# EAGLE design filter-test (EAGLE 9.6.2)
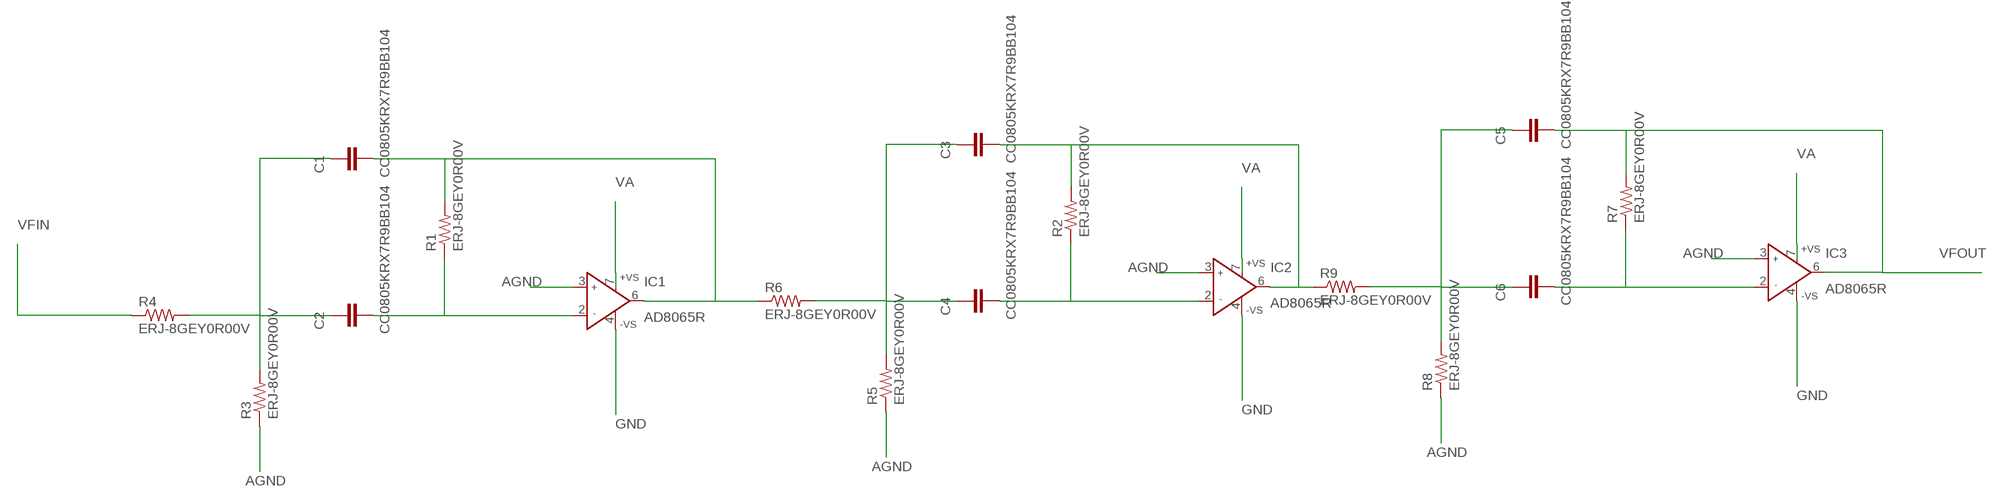
[diagram p0: schematic, sheet 1, part 1 of 2]
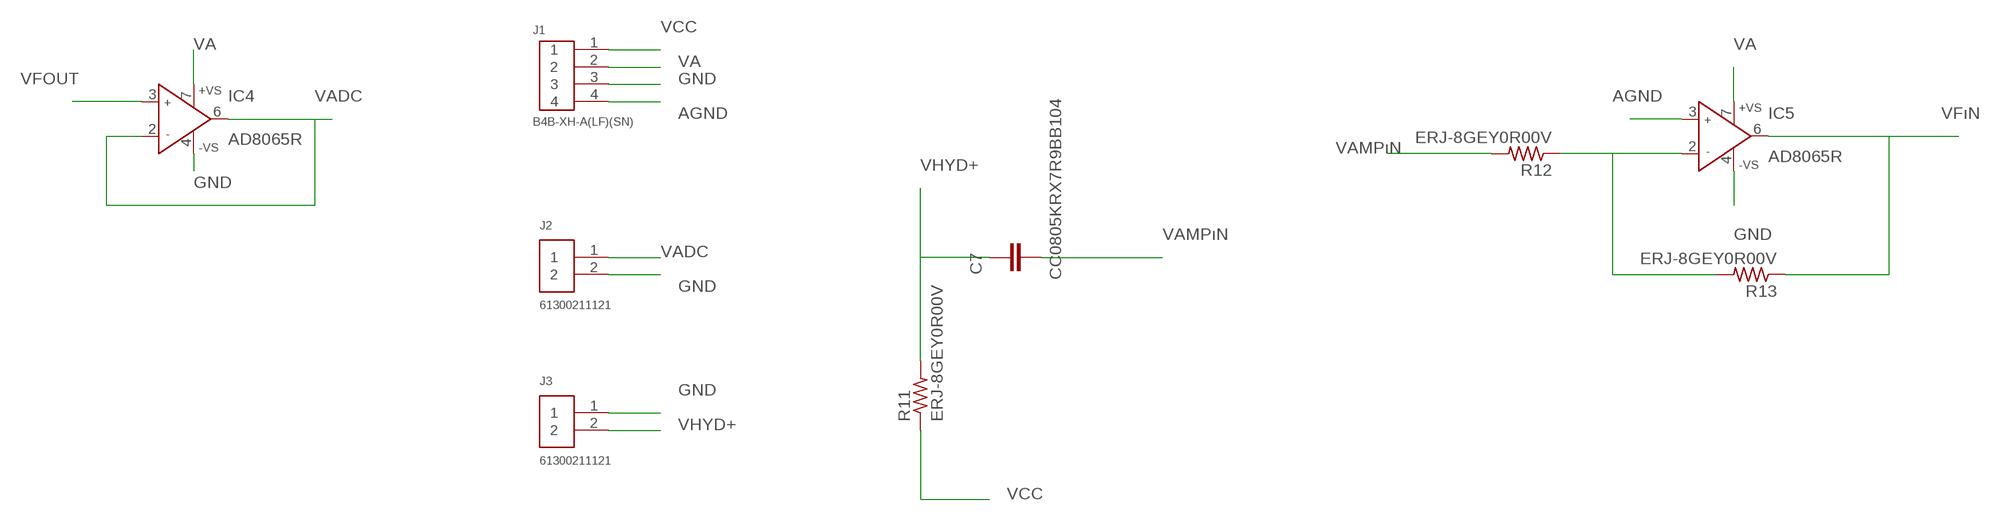
[diagram p1: schematic, sheet 1, part 2 of 2]

## Parts
C1  CC0805KRX7R9BB104  [CAP_0805]
C2  CC0805KRX7R9BB104  [CAP_0805]
C3  CC0805KRX7R9BB104  [CAP_0805]
C4  CC0805KRX7R9BB104  [CAP_0805]
C5  CC0805KRX7R9BB104  [CAP_0805]
C6  CC0805KRX7R9BB104  [CAP_0805]
C7  CC0805KRX7R9BB104  [CAP_0805]
IC1  AD8065R  [SO8]
IC2  AD8065R  [SO8]
IC3  AD8065R  [SO8]
IC4  AD8065R  [SO8]
IC5  AD8065R  [SO8]
J1  B4B-XH-A(LF)(SN)  [B4B-XH-A(LF)(SN)]
J2  61300211121  [61300211121]
J3  61300211121  [61300211121]
R1  ERJ-8GEY0R00V  [RES_1206]
R2  ERJ-8GEY0R00V  [RES_1206]
R3  ERJ-8GEY0R00V  [RES_1206]
R4  ERJ-8GEY0R00V  [RES_1206]
R5  ERJ-8GEY0R00V  [RES_1206]
R6  ERJ-8GEY0R00V  [RES_1206]
R7  ERJ-8GEY0R00V  [RES_1206]
R8  ERJ-8GEY0R00V  [RES_1206]
R9  ERJ-8GEY0R00V  [RES_1206]
R11  ERJ-8GEY0R00V  [RES_1206]
R12  ERJ-8GEY0R00V  [RES_1206]
R13  ERJ-8GEY0R00V  [RES_1206]

## Nets
AGND: IC1.3(IN+) IC2.3(IN+) IC3.3(IN+) IC5.3(IN+) J1.4 R3.1 R5.1 R8.1
GND: IC1.4(-VS) IC2.4(-VS) IC3.4(-VS) IC4.4(-VS) IC5.4(-VS) J1.3 J2.2 J3.1
N$1: C1.1 C2.1 R3.2 R4.2
N$2: C1.2 IC1.6(OUT) R1.2 R6.1
N$3: C2.2 IC1.2(IN-) R1.1
N$4: C3.1 C4.1 R5.2 R6.2
N$5: C3.2 IC2.6(OUT) R2.2 R9.1
N$6: C4.2 IC2.2(IN-) R2.1
N$7: IC5.2(IN-) R12.1 R13.2
N$8: C5.1 C6.1 R8.2 R9.2
N$10: C6.2 IC3.2(IN-) R7.1
VA: IC1.7(+VS) IC2.7(+VS) IC3.7(+VS) IC4.7(+VS) IC5.7(+VS) J1.2
VADC: IC4.2(IN-) IC4.6(OUT) J2.1
VAMPıN: C7.2 R12.2
VCC: J1.1 R11.1
VFIN: R4.1
VFOUT: C5.2 IC3.6(OUT) IC4.3(IN+) R7.2
VFıN: IC5.6(OUT) R13.1
VHYD+: C7.1 J3.2 R11.2

## Library data of the parts
C1-C7 = Resistor_Capacitor:CC0805KRX7R9BB104: CAP CER 0.1UF 50V X7R 0805 Manufacturer's datasheet <http://www.yageo.com/documents/recent/UPY-GPHC_X7R_6.3V-to-50V_18.pdf>; CREATED_BY: PCBLayout.com; DIGIKEY_PART_NUMBER: 311-1140-2-ND; MANUFACTURER: Yageo; MPN: CC0805KRX7R9BB104; PACKAGE: SMD 0805
IC1-IC5 = analog-devices:AD8065: High Performance, 145 MHz FastFET Op Amps Source: http://www.analog.com/static/imported-files/data_sheets/AD8065_8066.pdf; OC_FARNELL: unknown; OC_NEWARK: unknown
J1 = Headers:B4B-XH-A(LF)(SN): CONN HEADER VERT 4POS 2.5MM Manufacturer's datasheet <http://www.jst-mfg.com/product/pdf/eng/eXH.pdf>; CREATED_BY: PCBLayout.com; DIGIKEY_PARTNO: 455-2249-ND; MANUFACTURER: JST Sales America Inc.; MPN: B4B-XH-A(LF)(SN)
J2 J3 = Headers:61300211121: CONN HEADER VERT 2POS 2.54MM Manufacturer's datasheet <https://katalog.we-online.de/em/datasheet/6130xx11121.pdf>; CREATED_BY: PCBLayout.com; DIGI_KEY_PART_NUMBER: 732-5315-ND; MANUFACTURER: Wurth Electronics Inc.; MPN: 61300211121
R1-R9 R11-R13 = Resistor_Capacitor:ERJ-8GEY0R00V: RES SMD 0 OHM JUMPER 1/4W 1206 Manufacturer's datasheet <https://industrial.panasonic.com/ww/products/resistors/chip-resistors/general-purpose-chip-resistors/thick-film-chip-resistors/ERJ8GEY0R00V>; CREATED_BY: PCBLayout.com; DIGIKEY_PART_NUMBER: P0.0ETR-ND; MANUFACTURER: Panasonic Electronic Components; MPN: ERJ-8GEY0R00V; PACKAGE: SMD 1206

## Module AGND
Ports: 

### Library data of the parts

## Module GND
Ports: 

### Library data of the parts

## Board
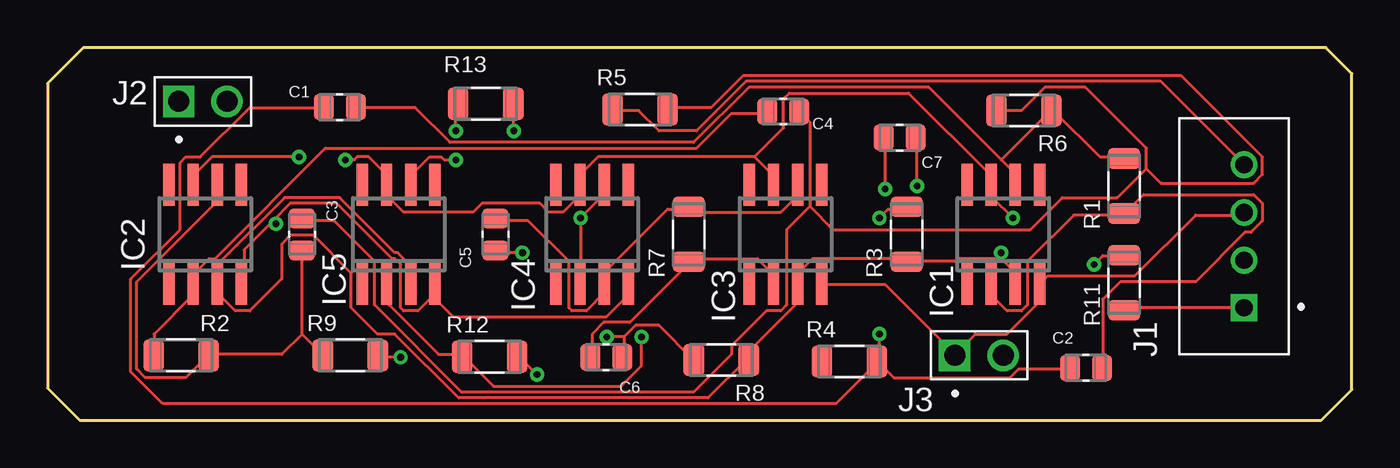
[diagram p2: board, top side]
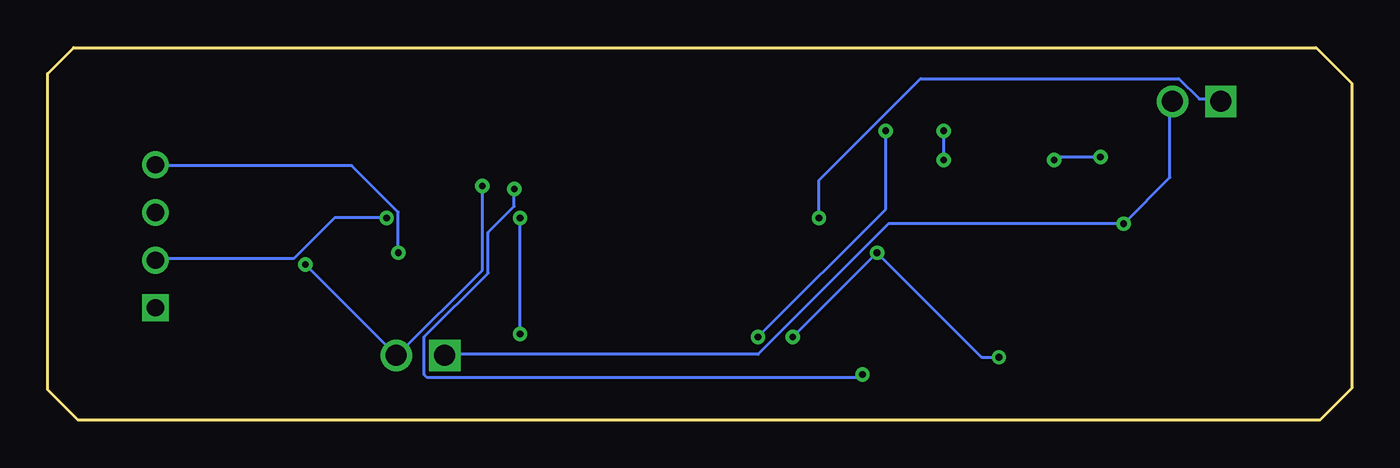
[diagram p3: board, bottom side, seen from below]

Size 68.5 x 19.56 mm. Coordinates in mm from the lower left corner, seen from the top.
Outline: 1.68,0 66.9,0 68.5,1.6 68.5,18.19 67.13,19.56 1.88,19.56 0,17.68 0,1.68 1.68,0
Copper layers (1*16): Top 0.035mm / dielectric 1.5mm / Bottom 0.035mm
Design rules "default": minimum track width 6mil, minimum drill 0.35mm, track to track 6mil, track to pad 6mil, pad to pad 6mil, via to via 6mil, smd to smd 6mil, copper to edge 40mil, drill to drill 6mil, minimum pad ring 10mil, minimum via ring 8mil, stop-mask expansion 4mil, vias tented up to drill 0mil, thermal gap 10mil

### Footprints (pad centres in the part's own frame; a part is rotated, then mirrored left to right if it is on the bottom)
CAP_0805 = smd 1.05 x 1.38: 1 -0.84,0; 2 0.84,0
SO8 = smd 0.6 x 2.2: 1 -1.905,-2.6; 2 -0.635,-2.6; 3 0.635,-2.6; 4 1.905,-2.6; 5 1.905,2.6; 6 0.635,2.6; 7 -0.635,2.6; 8 -1.905,2.6
B4B-XH-A(LF)(SN) = drill 0.9 square: 1 -3.75,0 | drill 0.9: 2 -1.25,0; 3 1.25,0; 4 3.75,0
61300211121 = drill 1.1 square: 1 -1.27,0 | drill 1.1: 2 1.27,0
RES_1206 = smd 1.08 x 1.68: 1 -1.445,0; 2 1.445,0

### Placement (x,y rotation side)
C1  15.34,16.43 0 top
C2  54.53,2.74 0 top
C3  13.36,9.75 270 top
C4  38.63,16.21 180 top
C5  23.52,9.75 90 top
C6  29.34,3.3 180 top
C7  44.75,14.83 180 top
IC1  50.19,9.75 0 top
IC2  8.28,9.75 0 top
IC3  38.76,9.75 0 top
IC4  28.6,9.75 0 top
IC5  18.44,9.75 0 top
J1  62.84,9.65 90 top
J2  8.15,16.74 0 top
J3  48.92,3.4 0 top
R1  56.54,12.29 90 top
R2  7.01,3.4 0 top
R3  45.11,9.75 90 top
R4  42.11,3.07 0 top
R5  31.12,16.31 0 top
R6  51.28,16.26 180 top
R7  33.68,9.75 90 top
R8  35.38,3.15 180 top
R9  15.9,3.4 0 top
R11  56.54,7.21 90 top
R12  23.22,3.33 0 top
R13  23.01,16.61 0 top

### Tracks (layer width: path | path; a pad name or v marks a point on that pad's centre or on a via)
AGND  (via drill 0.35)
  Top 0.152: R5.1 29.82,16.26 31.04,16.26 32.11,15.19 34.09,15.19 36.68,17.78 58.47,17.78 62.74,13.51 J1.4 | IC5.3 19,7.26 19,8.18 18.39,8.79 18.24,8.79 15.34,11.68 12.45,11.68 8.94,8.18 8.94,7.26 IC2.3 8.94,7.11 8.94,6.65 9.86,5.74 10.62,5.74 12.29,7.42 12.29,9.25 12.75,9.7 13.97,9.7 15.95,7.72 15.95,5.89 17.32,4.52 18.24,4.52 21.59,1.17 34.7,1.17 36.68,3.15 R8.1 36.83,3.61 39.27,6.05 39.27,7.11 IC3.3 39.42,7.26 39.42,7.72 40.18,8.48 44.91,8.48 45.06,8.33 R3.1 45.21,8.33 47.65,8.33 47.8,8.48 50.09,8.48 | 50.09,8.48 50.7,7.87 50.7,7.26 IC1.3 | 50.09,8.48 v50.09,8.79
  Bottom 0.152: v50.09,8.79 50.09,10.92 52.53,13.36 62.74,13.36 J1.4
GND  (via drill 0.35)
  Top 0.152: 47.65,3.45 43.99,7.11 40.79,7.11 IC3.4 | 47.65,3.45 48.72,4.52 50.39,4.52 52.07,6.2 52.07,7.11 IC1.4 52.22,7.26 52.53,7.57 57.1,7.57 60.3,10.77 62.74,10.77 J1.3 | 47.65,3.45 J3.1 | 11.84,10.46 12.75,11.38 15.19,11.38 18.08,8.48 18.24,8.48 18.54,8.18 18.54,5.89 18.69,5.74 19.46,5.74 20.22,6.5 | 11.84,10.46 10.31,8.94 10.31,7.26 IC2.4 | 20.22,6.5 20.22,7.11 IC5.4 20.22,6.5 | 20.22,6.5 21.29,5.44 29.36,5.44 30.43,6.5 30.43,7.11 IC4.4 | 11.84,10.46 v11.99,10.31
  Bottom 0.152: J2.2 9.55,16.71 9.55,12.75 v11.99,10.31 24.33,10.31 31.19,3.45 47.65,3.45 J3.1
N$1  (via drill 0.35)
  Top 0.152: C1.1 14.43,16.41 10.62,16.41 8.03,13.82 7.26,13.82 6.96,13.51 6.96,10.01 4.37,7.42 4.37,2.54 6.05,0.86 41.4,0.86 43.54,3 R4.2 | C2.1 53.59,2.69 51,2.69 50.55,2.24 44.45,2.24 43.69,3 R4.2 | v43.69,10.62 44.15,11.07 45.06,11.07 R3.2 | v43.69,4.52 43.69,3.15 R4.2
  Bottom 0.152: v43.69,4.52 v43.69,10.62
N$2
  Top 0.152: 50.09,13.67 50.7,13.06 50.7,12.45 IC1.6 | 50.09,13.67 46.28,17.48 36.83,17.48 33.93,14.58 21.13,14.58 19.3,16.41 16.26,16.41 C1.2 | 50.09,13.67 52.68,16.26 R6.1 52.83,16.26 55.27,13.82 56.49,13.82 R1.2
N$3
  Top 0.152: C2.2 55.42,2.84 55.42,6.35 56.34,7.26 60.3,7.26 62.89,9.86 63.2,9.86 63.8,10.46 63.8,11.38 63.35,11.84 57.56,11.84 56.64,10.92 R1.1 56.49,10.77 53.9,10.77 51.46,8.33 51.46,6.05 51.16,5.74 50.39,5.74 49.63,6.5 49.63,7.11 IC1.2
N$4
  Top 0.152: 40.03,11.23 38.81,10.01 38.81,6.05 38.51,5.74 37.74,5.74 35.92,3.91 35.92,3.45 33.93,1.47 21.74,1.47 17.17,6.05 17.17,8.33 15.04,10.46 13.36,10.46 C3.1 | 40.03,11.23 40.03,15.65 39.57,16.1 C4.1 | R6.2 51.16,16.26 52.37,17.48 54.51,17.48 57.71,14.27 57.71,13.21 | 57.71,13.21 56.18,11.68 53.29,11.68 51.61,10.01 41.25,10.01 40.03,11.23 | 57.71,13.21 58.47,12.45 63.35,12.45 63.8,12.9 63.8,13.82 59.54,18.08 36.53,18.08 34.85,16.41 32.56,16.41 R5.2
N$5
  Top 0.152: 13.36,4.52 C3.2 | 13.36,4.52 14.43,3.45 R9.1 | 13.36,4.52 12.29,3.45 8.48,3.45 R2.2 8.33,3.3 7.26,2.24 5.13,2.24 4.67,2.69 4.67,7.26 8.79,11.38 8.79,12.29 IC2.6
N$6
  Top 0.152: C4.2 37.74,16.1 35.92,16.1 34.09,14.27 14.58,14.27 8.79,8.48 8.48,8.48 7.72,7.72 7.72,7.26 IC2.2 7.57,7.11 7.57,6.5 5.59,4.52 5.59,3.45 R2.1
N$7  (via drill 0.35)
  Top 0.152: IC5.2 17.93,7.11 17.93,6.05 20.52,3.45 21.74,3.45 R12.1 21.89,3.3 23.42,1.78 30.12,1.78 31.19,2.84 v31.19,4.37 | v24.49,15.19 24.49,16.56 R13.2
  Bottom 0.152: v24.49,15.19 24.49,11.07 v31.19,4.37
N$8  (via drill 0.35)
  Top 0.152: 30.28,4.37 30.28,3.3 C6.1 | 30.28,4.37 30.89,4.98 32.11,4.98 R8.2 | v24.94,8.79 23.57,8.79 C5.1 | 30.28,4.37 v29.36,4.37 | v18.54,3.3 17.48,3.3 R9.2
  Bottom 0.152: v29.36,4.37 v24.94,8.79 19.46,3.3 v18.54,3.3
N$10
  Top 0.152: C6.2 28.6,3.3 28.6,4.52 29.21,5.13 30.58,5.13 33.63,8.18 R7.1 33.78,8.33 33.93,8.48 37.29,8.48 38.05,7.72 38.05,7.26 IC3.2
VA  (via drill 0.35)
  Top 0.152: v13.21,13.82 8.64,13.82 7.72,12.9 7.72,12.45 IC2.7 | v15.65,13.67 16.1,13.67 16.26,13.82 16.87,13.82 17.78,12.9 17.78,12.45 IC5.7 17.93,12.29 17.93,11.68 18.69,10.92 22.35,10.92 22.81,11.38 25.86,11.38 26.31,10.92 27.08,10.92 27.84,11.68 27.84,12.29 IC4.7 27.99,12.45 27.99,12.9 28.91,13.82 37.13,13.82 | 37.13,13.82 38.05,12.9 38.05,12.45 IC3.7 | 37.13,13.82 38.66,15.34 38.66,16.87 38.96,17.17 45.21,17.17 49.48,12.9 49.48,12.45 IC1.7 49.63,12.29 49.63,11.68 v50.7,10.62
  Bottom 0.152: v13.21,13.82 15.49,13.82 v15.65,13.67 | v50.7,10.62 53.44,10.62 55.58,8.48 62.74,8.48 J1.2
VADC  (via drill 0.35)
  Top 0.152: IC4.2 27.99,7.26 v27.99,10.62 29.21,11.84 29.21,12.29 IC4.6
  Bottom 0.152: v27.99,10.62 27.99,12.6 22.66,17.93 9.09,17.93 8.03,16.87 6.96,16.87 J2.1
VAMPıN  (via drill 0.35)
  Top 0.152: v43.99,12.14 43.99,14.73 C7.2 | v25.7,2.39 24.79,3.3 R12.2
  Bottom 0.152: v43.99,12.14 43.99,11.23 45.36,9.86 45.36,7.72 48.72,4.37 48.72,2.39 48.56,2.24 25.86,2.24 v25.7,2.39
VCC
  Top 0.152: R11.1 56.64,5.89 62.74,5.89 J1.1
VFOUT
  Top 0.152: C5.2 23.57,10.46 25.25,10.46 27.38,8.33 27.38,5.89 27.53,5.74 28.3,5.74 29.21,6.65 29.21,7.11 IC4.3 29.36,7.26 29.36,7.87 32.56,11.07 33.63,11.07 R7.2 33.78,11.07 33.93,10.92 38.51,10.92 39.27,11.68 39.27,12.29 IC3.6
VFıN  (via drill 0.35)
  Top 0.152: v21.44,15.19 21.44,16.56 R13.1 | v21.44,13.67 20.83,13.67 20.68,13.82 20.07,13.82 19.15,12.9 19.15,12.45 IC5.6
  Bottom 0.152: v21.44,13.67 v21.44,15.19
VHYD+  (via drill 0.35)
  Top 0.152: v45.67,12.29 45.67,14.73 C7.1 | v54.97,8.18 55.42,8.64 56.49,8.64 R11.2
  Bottom 0.152: v45.67,12.29 45.67,7.87 50.09,3.45 J3.2 v54.97,8.18